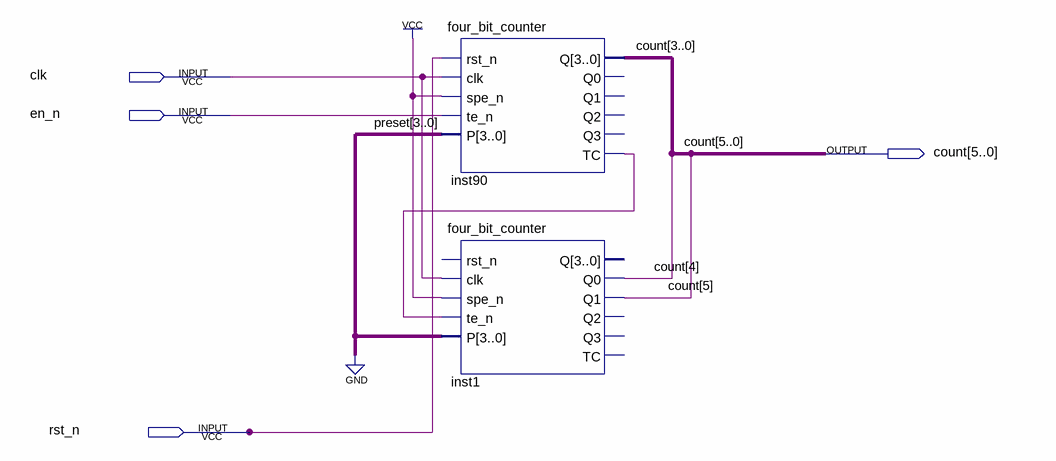
[diagram p0: schematic sheet]
// Quartus schematic counter.bdf as structural Verilog: 2 symbols, 4 pins
module counter (
  input  clk,
  input  en_n,
  input  rst_n,
  output [5:0] count
);

  wire inst90_tc;

  four_bit_counter inst90 (
    .rst_n(rst_n), .clk(clk), .spe_n(1'b1), .te_n(en_n), .P(4'b0000), .Q(count[3:0]), .TC(inst90_tc));  // open: Q0, Q1, Q2, Q3
  four_bit_counter inst1 (
    .clk(clk), .spe_n(1'b1), .te_n(inst90_tc), .P(4'b0000), .Q0(count[4]), .Q1(count[5]));  // open: rst_n, Q, Q2, Q3, TC
endmodule
